# Altium schematic sheet EEG AFE Sheet 2.SchDoc
size A4; SheetNumber: 2; SheetTotal: 4
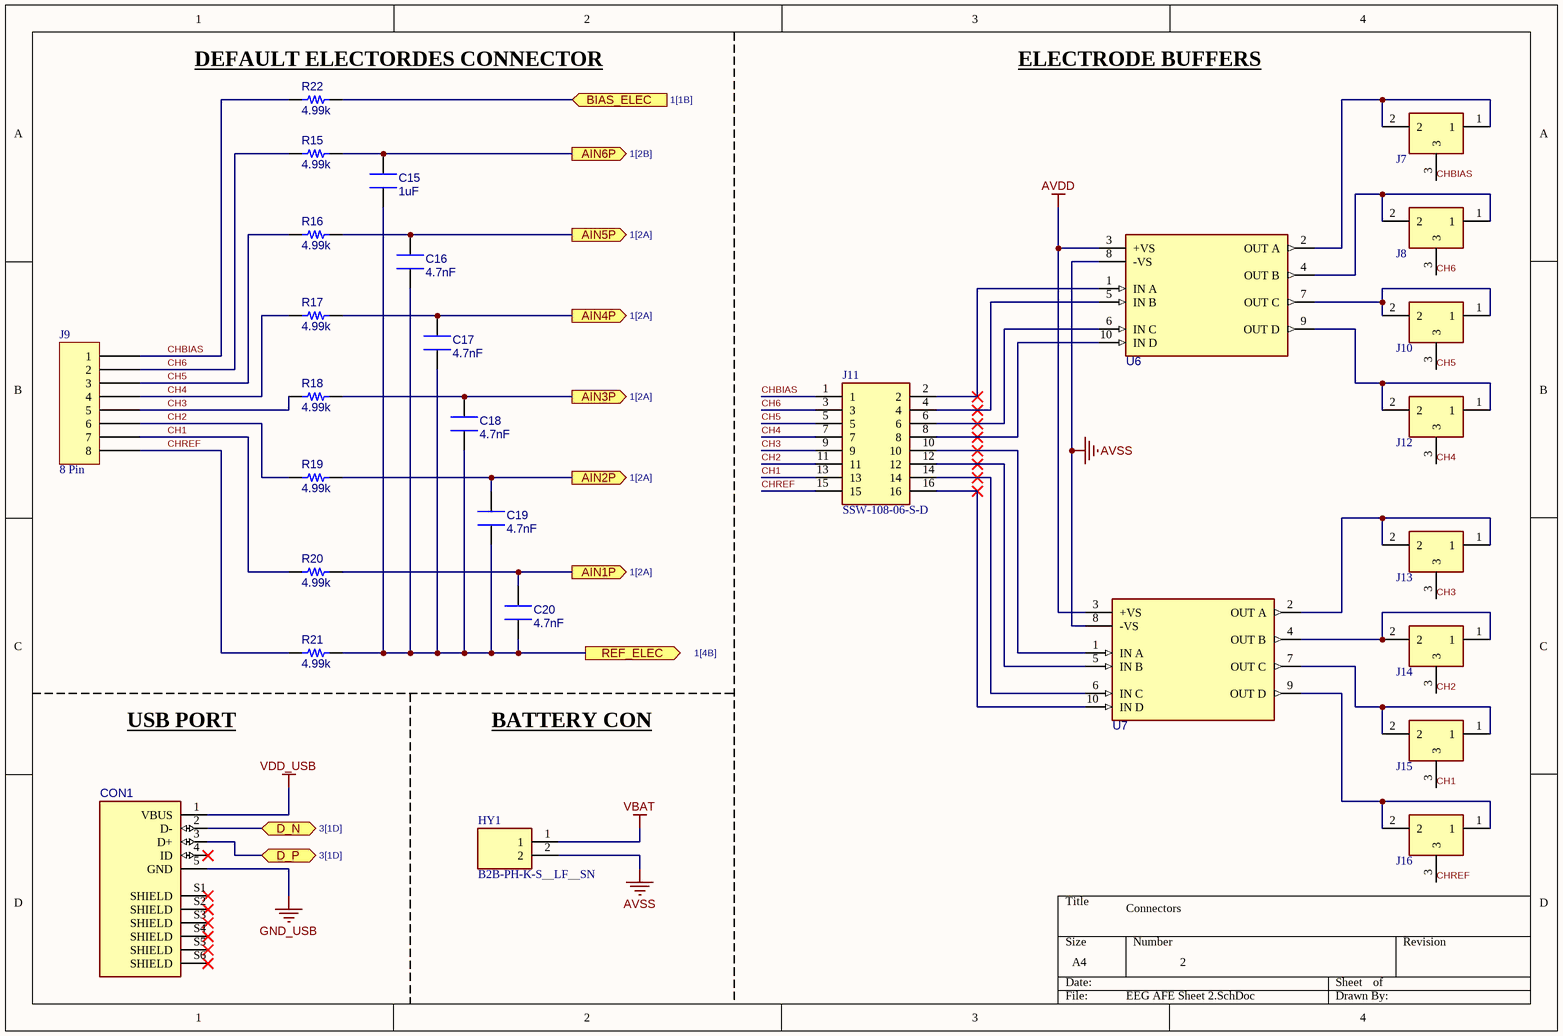
[diagram p0: EEG AFE Sheet 2.SchDoc]

## Parts
C15  1uF  [CAP 0603_1608]
C16  4.7nF  [CAP 0603_1608]
C17  4.7nF  [CAP 0603_1608]
C18  4.7nF  [CAP 0603_1608]
C19  4.7nF  [CAP 0603_1608]
C20  4.7nF  [CAP 0603_1608]
CON1  *  [AMPHENOL_10118194-0011LF]  (value not drawn)
HY1  B2B-PH-K-S__LF__SN  [B2BPHKSLFSN]
J7  U.FL-R-SMT-1_10_  [U.FL-R-SMT-1(10)]  (value not drawn)
J8  U.FL-R-SMT-1_10_  [U.FL-R-SMT-1(10)]  (value not drawn)
J9  8 Pin  [SAMTEC SSW-108-03-T-S]
J10  U.FL-R-SMT-1_10_  [U.FL-R-SMT-1(10)]  (value not drawn)
J11  SSW-108-06-S-D  [SSW-108-XX-YYY-D]
J12  U.FL-R-SMT-1_10_  [U.FL-R-SMT-1(10)]  (value not drawn)
J13  U.FL-R-SMT-1_10_  [U.FL-R-SMT-1(10)]  (value not drawn)
J14  U.FL-R-SMT-1_10_  [U.FL-R-SMT-1(10)]  (value not drawn)
J15  U.FL-R-SMT-1_10_  [U.FL-R-SMT-1(10)]  (value not drawn)
J16  U.FL-R-SMT-1_10_  [U.FL-R-SMT-1(10)]  (value not drawn)
R15  4.99k  [RES 0603_1608]
R16  4.99k  [RES 0603_1608]
R17  4.99k  [RES 0603_1608]
R18  4.99k  [RES 0603_1608]
R19  4.99k  [RES 0603_1608]
R20  4.99k  [RES 0603_1608]
R21  4.99k  [RES 0603_1608]
R22  4.99k  [RES 0603_1608]
U6  *  [FP-RM-10-IPC_B]  (value not drawn)
U7  *  [FP-RM-10-IPC_B]  (value not drawn)

## Ports
AIN1P (out, see 1[2A]), AIN2P (out, see 1[2A]), AIN3P (out, see 1[2A]), AIN4P (out, see 1[2A]), AIN5P (out, see 1[2A]), AIN6P (out, see 1[2B]), BIAS_ELEC (in, see 1[1B]), D_N (bidir, see 3[1D]), D_P (bidir, see 3[1D]), REF_ELEC (out, see 1[4B])

## Nets
AVDD: U6.3(+VS) U7.3(+VS)
AVSS: HY1.2 U6.8(-VS) U7.8(-VS)
GND_USB: CON1.5(GND)
VBAT: HY1.1
VDD_USB: CON1.1(VBUS)
AIN1P: C20.1 R20.2 ; port AIN1P
AIN2P: C19.1 R19.2 ; port AIN2P
AIN3P: C18.1 R18.2 ; port AIN3P
AIN4P: C17.1 R17.2 ; port AIN4P
AIN5P: C16.1 R16.2 ; port AIN5P
AIN6P: C15.1 R15.2 ; port AIN6P
BIAS_ELEC: R22.2 ; port BIAS_ELEC
CH1: J9.7 J11.13 J15.3 R20.1
CH2: J9.6 J11.11 J14.3 R19.1
CH3: J9.5 J11.9 J13.3 R18.1
CH4: J9.4 J11.7 J12.3 R17.1
CH5: J9.3 J10.3 J11.5 R16.1
CH6: J8.3 J9.2 J11.3 R15.1
CHBIAS: J7.3 J9.1 J11.1 R22.1
CHREF: J9.8 J11.15 J16.3 R21.1
D_N: CON1.2(D-) ; port D_N
D_P: CON1.3(D+) ; port D_P
REF_ELEC: C15.2 C16.2 C17.2 C18.2 C19.2 C20.2 R21.2 ; port REF_ELEC
NetJ7_1: J7.1 J7.2 U6.2(OUT_A)
NetJ8_1: J8.1 J8.2 U6.4(OUT_B)
NetJ10_1: J10.1 J10.2 U6.7(OUT_C)
NetJ11_2: J11.2 U6.1(IN_A)
NetJ11_4: J11.4 U6.5(IN_B)
NetJ11_6: J11.6 U6.6(IN_C)
NetJ11_8: J11.8 U6.10(IN_D)
NetJ11_10: J11.10 U7.1(IN_A)
NetJ11_12: J11.12 U7.5(IN_B)
NetJ11_14: J11.14 U7.6(IN_C)
NetJ11_16: J11.16 U7.10(IN_D)
NetJ12_1: J12.1 J12.2 U6.9(OUT_D)
NetJ13_1: J13.1 J13.2 U7.2(OUT_A)
NetJ14_1: J14.1 J14.2 U7.4(OUT_B)
NetJ15_1: J15.1 J15.2 U7.7(OUT_C)
NetJ16_1: J16.1 J16.2 U7.9(OUT_D)

Not connected (* = marked no-connect by the designer): CON1 4(ID)* S1(SHIELD)* S2(SHIELD)* S3(SHIELD)* S4(SHIELD)* S5(SHIELD)* S6(SHIELD)*

## Notes on the sheet
- (near R22) DEFAULT ELECTORDES CONNECTOR
- ELECTRODE BUFFERS
- USB PORT
- BATTERY CON
- Connectors
- 2

## Library data of the parts
C15-C20 = 08055C104KAT2A: Ceramic Capacitor, Multilayer, Ceramic, 50V, 10% +Tol, 10% -Tol, X7R, 15% TC, 0.1uF, Surface Mount, 0805; Manufacturer: ???; Capacitance: 100nF; Multilayer: Yes; Package: CAP 0603_1608; Part Number: *; Value: *; Voltage: *; Tolerance: *; ComponentLink1Description: Datasheet; Current Rating: *; Supplier 1: Mouser; Manufacturer Part Number: 08055C104KAT2A; RoHS: Yes; Category: Ceramic Capacitors; Stock 1: 1865681; Pricing 1: 1=0.1, 10=0.037, 50=0.037, 100=0.022, 1000=0.017, 10000=0.013 (USD); Mount: Surface Mount; Number of Pins: 2; Dielectric Material: Ceramic; Package Shape: Rectangular; Size Code: 0805; Terminal Finish: Nickel; Min Operating Temperature: -55°C; Max Operating Temperature: 125°C; JESD-609 Code: e3; Capacitor Type: Ceramic; Negative Tolerance: 10%; Package Style: SMTMeter; Packaging: Tape and Reel; Positive Tolerance: 10%; Rated DC Voltage (URdc): 50V; Temperature Characteristics Code: X7R; Termination: Wraparound; Length: 2.01mm; Width: 1.25mm; Height: 0.94mm; Reach SVHC Compliant: Yes; RoHS Compliant: Yes; ComponentLink2URL: https://datasheet.ciiva.com:443/pdfs/VipMasterIC/IC/AVXC/AVXC-S-A0009640452/AVXC-S-A0009640452-1.pdf?src-supplier=IHS+Markit; ComponentLink2Description: https://datasheet.ciiva.com:443/pdfs/VipMasterIC/IC/AVXC/AVXC-S-A0009640452/AVXC-S-A0009640452-1.pdf?src-supplier=IHS+Markit; ComponentLink3URL: https://datasheet.ciiva.com/19475/2009691-19475858.pdf?src-supplier=Jameco; ComponentLink3Description: https://datasheet.ciiva.com/19475/2009691-19475858.pdf?src-supplier=Jameco; ComponentLink4URL: https://datasheet.ciiva.com/11786/0900766b802d4698-11786116.pdf?src-supplier=Rs; ComponentLink4Description: https://datasheet.ciiva.com/11786/0900766b802d4698-11786116.pdf?src-supplier=Rs; ComponentLink5URL: https://datasheet.ciiva.com/2988/cx7r-2988014.pdf?src-supplier=Avnet; ComponentLink5Description: https://datasheet.ciiva.com/2988/cx7r-2988014.pdf?src-supplier=Avnet; ComponentLink6URL: https://datasheet.ciiva.com/16199/cx7r-16199014.pdf?src-supplier=Future+Electronics; ComponentLink6Description: https://datasheet.ciiva.com/16199/cx7r-16199014.pdf?src-supplier=Future+Electronics; ComponentLink7URL: https://datasheet.ciiva.com/11504/cx7r-11504044.pdf?src-supplier=Avnet; ComponentLink7Description: https://datasheet.ciiva.com/11504/cx7r-11504044.pdf?src-supplier=Avnet; ComponentLink8URL: https://datasheet.ciiva.com/150/cx7r-150258.pdf?src-supplier=Digi-Key; ComponentLink8Description: https://datasheet.ciiva.com/150/cx7r-150258.pdf?src-supplier=Digi-Key; ComponentLink9URL: https://datasheet.ciiva.com/150/cx7r-150257.pdf?src-supplier=Digi-Key; ComponentLink9Description: https://datasheet.ciiva.com/150/cx7r-150257.pdf?src-supplier=Digi-Key; ComponentLink10URL: https://datasheet.ciiva.com/150/cx7r-150259.pdf?src-supplier=Digi-Key; ComponentLink10Description: https://datasheet.ciiva.com/150/cx7r-150259.pdf?src-supplier=Digi-Key; ComponentLink11URL: https://datasheet.ciiva.com/7812/cx7r-7812079.pdf?src-supplier=Element14; ComponentLink11Description: https://datasheet.ciiva.com/7812/cx7r-7812079.pdf?src-supplier=Element14; ComponentLink12URL: https://datasheet.ciiva.com/5416/cx7r-5416959.pdf?src-supplier=Mouser; ComponentLink12Description: https://datasheet.ciiva.com/5416/cx7r-5416959.pdf?src-supplier=Mouser; Supplier Part Number 1: 581-08055C104K
CON1 = 10118194-0011LF: USB - micro B USB 2.0 Receptacle Connector 5 Position Surface Mount, Right Angle; Manufacturer: ???; Package: AMPHENOL_10118194-0011LF; Publisher: Paraqum Technologies; Part Number: *; Value: *; Voltage: *; Tolerance: *; ComponentLink1Description: Datasheet; Current Rating: *; Supplier 1: Mouser; Manufacturer Part Number: 10118194-0011LF; RoHS: No; Category: Connectors; Stock 1: 18804; Pricing 1: 1=0.59, 10=0.49, 50=0.49, 100=0.419, 1000=0.342, 10000=0.237 (USD); Supplier Part Number 1: 649-10118194-0011LF
HY1 = B2B-PH-K-S__LF__SN_: Circulator or Directional Coupler; Manufacturer_Name: JST (JAPAN SOLDERLESS TERMINALS); Manufacturer_Part_Number: B2B-PH-K-S (LF)(SN); Datasheet Link: http://www.jst-mfg.com/product/pdf/eng/ePH.pdf; Height: 6mm
J7 J8 J10 J12-J16 = U.FL-R-SMT-1_10_: Connector; Manufacturer_Name: Hirose; Datasheet Link: https://www.hirose.com/product/document?clcode=CL0331-0472-2-10&productname=U.FL-R-SMT-1(10)&series=U.FL&documenttype=2DDrawing&lang=en&documentid=0000940684; Manufacturer_Part_Number: U.FL-R-SMT-1(10); Mouser Part Number: 798-U.FL-R-SMT-110; Mouser Price/Stock: https://www.mouser.co.uk/ProductDetail/Hirose-Connector/U.FL-R-SMT-110?qs=kL1ClTr6oBoOdtqlGQpQrQ%3D%3D; Arrow Part Number: U.FL-R-SMT-1(10); Arrow Price/Stock: https://www.arrow.com/en/products/u.fl-r-smt-1-10/hirose-electric
J11 = SSW-108-06-S-D: Connector; Manufacturer_Name: SAMTEC; Datasheet Link: http://suddendocs.samtec.com/prints/ssw-1xx-xx-xxx-x-xx-xxx-xx-mkt.pdf; Manufacturer_Part_Number: SSW-108-06-S-D; Arrow Part Number: SSW-108-06-S-D; Arrow Price/Stock: https://www.arrow.com/en/products/ssw-108-06-s-d/samtec
R15-R22 = RC0805FR-0710KL: Fixed Resistor, Metal Glaze/thick Film, 0.125W, 10000ohm, 150V, 1% +/-Tol, 100ppm/Cel, Surface Mount, 0805; Manufacturer: ???; Additional Feature: LASER TRIMMABLE; Rated Power Dissipation (P): 125mW; Rated Temperature: 70°C; Resistance: 10kR; Temperature Coefficient: 100ppm/°C; Package Height: 0.5mm; Package Length: 2mm; Package Width: 1.25mm; Package: RES 0603_1608; Publisher: Paraqum Technologies; Part Number: *; Value: *; Voltage: *; Tolerance: *; ComponentLink1Description: Datasheet; Current Rating: *; Supplier 1: Mouser; Manufacturer Part Number: RC0805FR-0710KL; RoHS: Yes; Category: Chip SMD Resistors; Stock 1: 8413916; Pricing 1: 1=0.1, 10=0.034, 50=0.034, 100=0.014, 1000=0.007, 10000=0.004 (USD); Mount: Surface Mount; Number of Pins: 2; Package Shape: Rectangular; Size Code: 0805; Terminal Finish: Nickel; Min Operating Temperature: -55°C; Max Operating Temperature: 155°C; JESD-609 Code: e3; Termination: Wraparound; Resistor Type: FIXED RESISTOR; Construction: Chip; Package Style: SMTMeter; Packaging: Tape and Reel; Technology: METAL GLAZE/THICK FILM; Working Voltage: 150V; Reach SVHC Compliant: Yes; RoHS Compliant: Yes; ComponentLink2URL: https://datasheet.ciiva.com:443/pdfs/VipMasterIC/IC/YAGO/YAGO-S-A0008145938/YAGO-S-A0008145938-1.pdf?src-supplier=IHS+Markit; ComponentLink2Description: https://datasheet.ciiva.com:443/pdfs/VipMasterIC/IC/YAGO/YAGO-S-A0008145938/YAGO-S-A0008145938-1.pdf?src-supplier=IHS+Markit; ComponentLink3URL: https://datasheet.ciiva.com/46447/444164-46447563.pdf?src-supplier=Element14; ComponentLink3Description: https://datasheet.ciiva.com/46447/444164-46447563.pdf?src-supplier=Element14; ComponentLink4URL: https://datasheet.ciiva.com/2456/pyu-r-int-thick-7-2456973.pdf?src-supplier=Digi-Key; ComponentLink4Description: https://datasheet.ciiva.com/2456/pyu-r-int-thick-7-2456973.pdf?src-supplier=Digi-Key; ComponentLink5URL: https://datasheet.ciiva.com/2456/pyu-r-int-thick-7-2456974.pdf?src-supplier=Digi-Key; ComponentLink5Description: https://datasheet.ciiva.com/2456/pyu-r-int-thick-7-2456974.pdf?src-supplier=Digi-Key; ComponentLink6URL: https://datasheet.ciiva.com/2456/pyu-r-int-thick-7-2456972.pdf?src-supplier=Digi-Key; ComponentLink6Description: https://datasheet.ciiva.com/2456/pyu-r-int-thick-7-2456972.pdf?src-supplier=Digi-Key; ComponentLink7URL: https://datasheet.ciiva.com/12669/rc0805-12669688.pdf?src-supplier=Mouser; ComponentLink7Description: https://datasheet.ciiva.com/12669/rc0805-12669688.pdf?src-supplier=Mouser; ComponentLink8URL: https://datasheet.ciiva.com/16747/rc0805-16747087.pdf?src-supplier=Future+Electronics; ComponentLink8Description: https://datasheet.ciiva.com/16747/rc0805-16747087.pdf?src-supplier=Future+Electronics; Supplier Part Number 1: 603-RC0805FR-0710KL
U6 U7 = AD8244BRMZ: Buffer Amplifier, 4 Func, BIPolar, PDSO10; Manufacturer: ???; Package Body Material: Plastic; Average Bias Current-Max (IIB): 2pA; Bandwidth (3dB)-Nom: 3.3MHz; Bias Current-Max (IIB) @25C: 3pA; Input Offset Voltage-Max: 350uV; Neg Supply Voltage Limit-Max: -18V; Neg Supply Voltage-Nom (Vsup): -5V; Number of Functions: 4; Package Equivalence Code: TSSOP10,.19,20; Power Supplies: +-5/+-15V; Slew Rate: 0.8V/µs; Max Supply Current: 1.2mA; Supply Voltage Limit-Max: 18V; Supply Voltage-Nom (Vsup): 5V; Qualification Status: Not Qualified; Package: FP-RM-10-IPC_B; Publisher: Paraqum Technologies; Part Number: *; Value: *; Voltage: *; Tolerance: *; ComponentLink1Description: Datasheet; Current Rating: *; Supplier 1: Mouser; Manufacturer Part Number: AD8244BRMZ; RoHS: Yes; Category: Amplifiers - Op Amps, Buffer, Instrumentation; Stock 1: 3011; Pricing 1: 1=8.33, 10=7.52, 50=7.16, 100=6.22, 1000=4.94, 10000=4.94 (USD); Package Code: TSSOP; Number of Pins: 10; Package Shape: Square; Min Operating Temperature: -40°C; Max Operating Temperature: 85°C; Amplifier Type: BUFFER; JESD-30 Code: S-PDSO-G10; Package Style: SMALL OUTLINE, THIN PROFILE, SHRINK PITCHMeter; Surface Mount: Yes; Technology: BIPOLAR; Terminal Form: Gull Wing; Terminal Position: DUAL; Length: 3mm; Width: 3mm; Height - Seated (Max): 1.1mm; Terminal Pitch: 0.5mm; Reach SVHC Compliant: Yes; RoHS Compliant: Yes; Temperature Grade: INDUSTRIAL; ComponentLink2URL: https://datasheet.ciiva.com:443/pdfs/VipMasterIC/IC/ANDI/ANDI-S-A0000496428/ANDI-S-A0000496428-1.pdf?src-supplier=IHS+Markit; ComponentLink2Description: https://datasheet.ciiva.com:443/pdfs/VipMasterIC/IC/ANDI/ANDI-S-A0000496428/ANDI-S-A0000496428-1.pdf?src-supplier=IHS+Markit; ComponentLink3URL: https://datasheet.ciiva.com/29970/ad8244-29970485.pdf?src-supplier=Avnet; ComponentLink3Description: https://datasheet.ciiva.com/29970/ad8244-29970485.pdf?src-supplier=Avnet; Supplier Part Number 1: 584-AD8244BRMZ